# Altium schematic sheet System Control - Power.SchDoc
size C
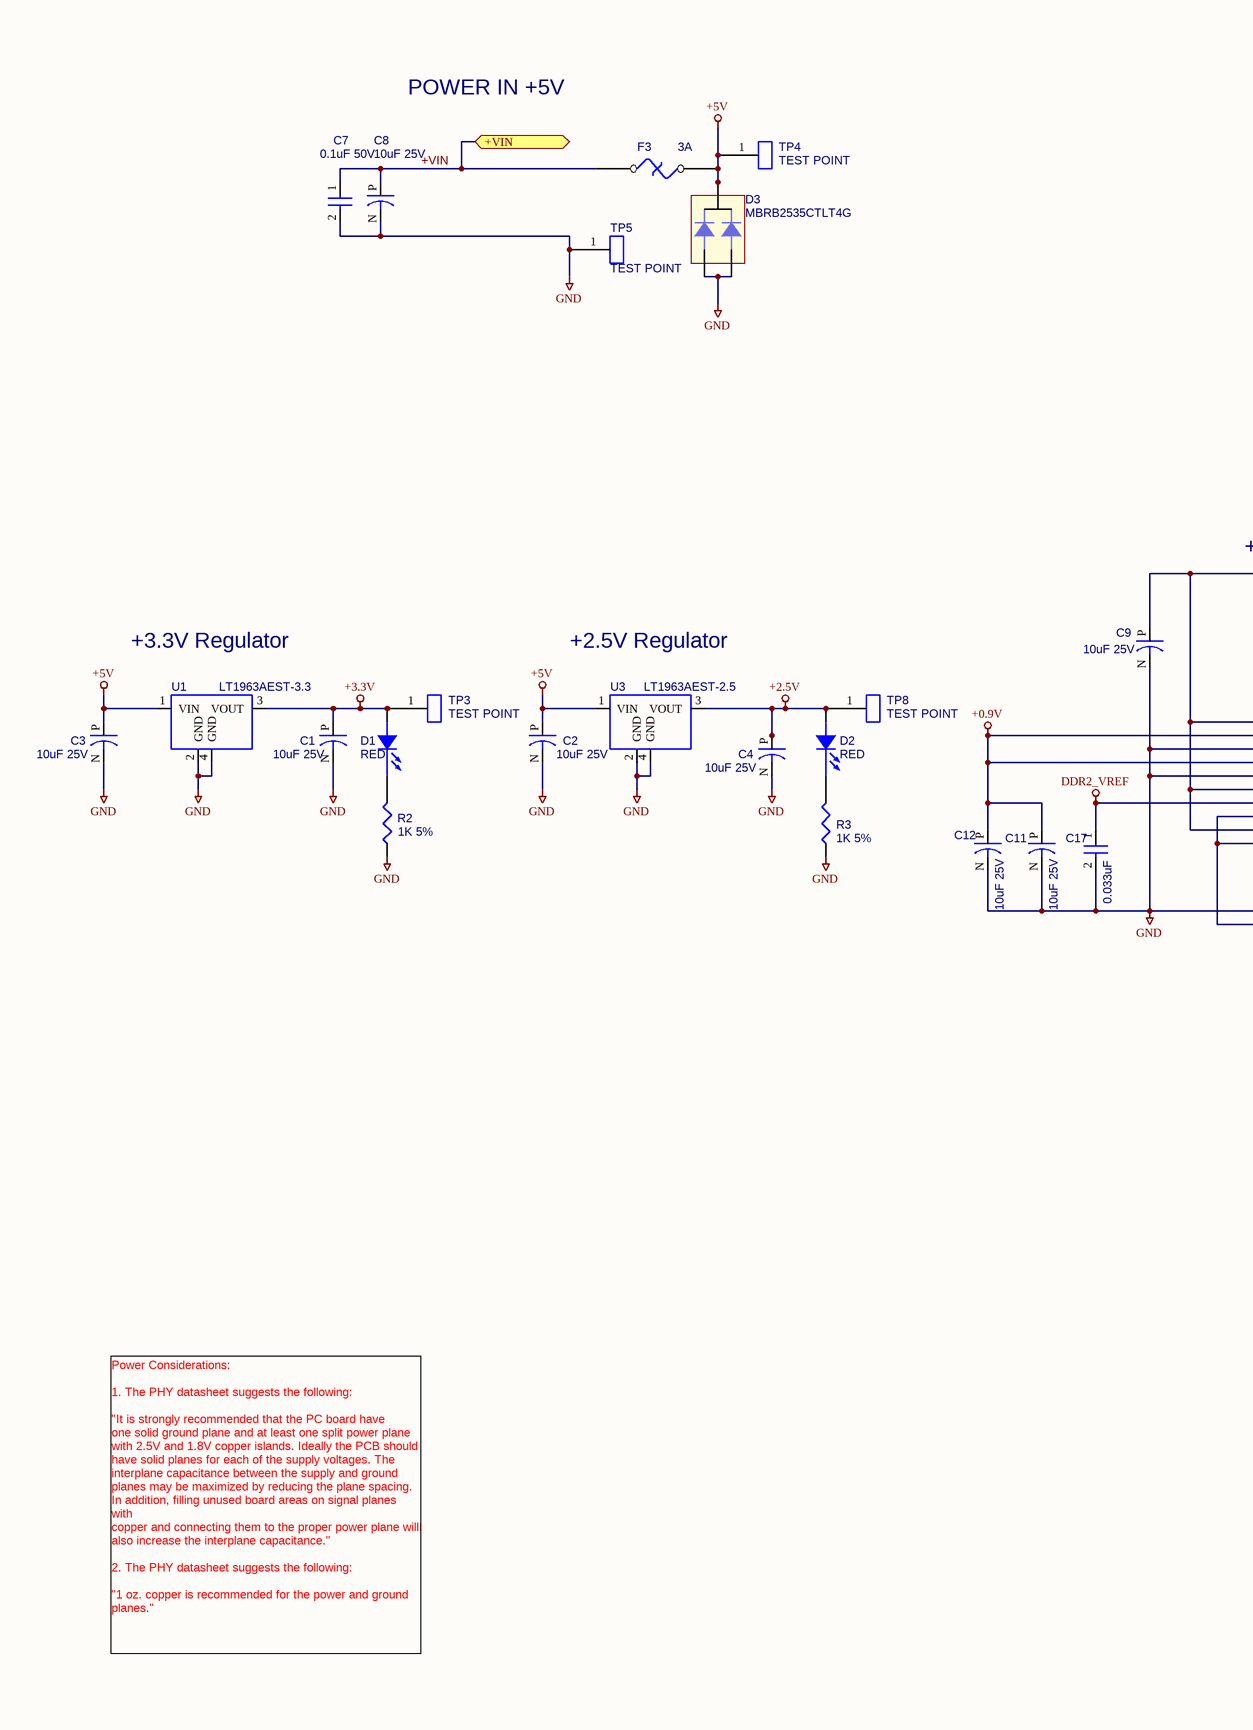
[diagram p0: System Control - Power.SchDoc, left]
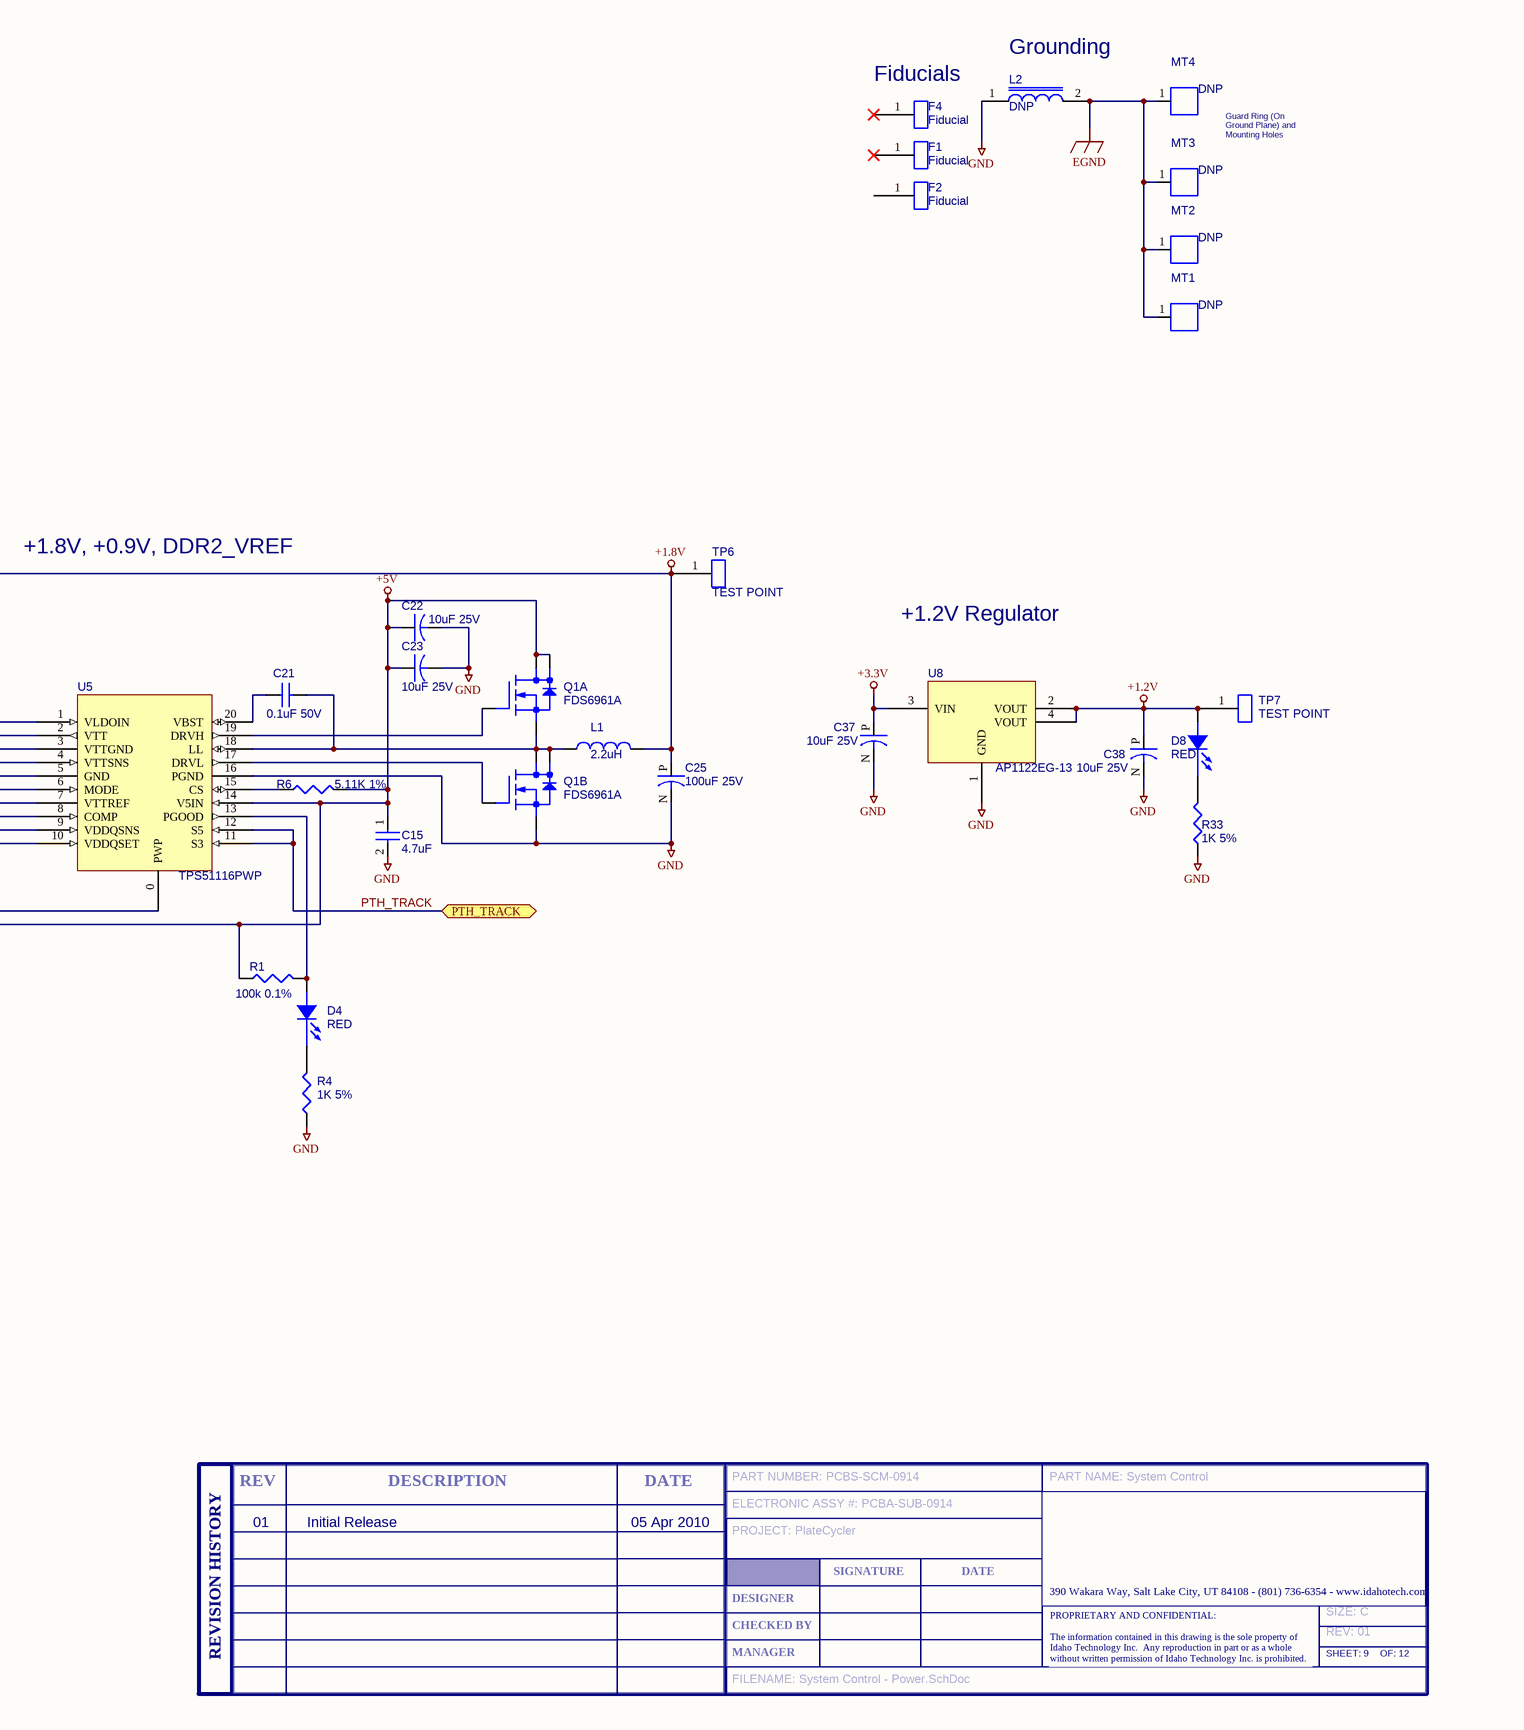
[diagram p1: System Control - Power.SchDoc, right]

## Parts
C1  10uF 25V  [SM/CT_6032]
C2  10uF 25V  [SM/CT_6032]
C3  10uF 25V  [SM/CT_6032]
C4  10uF 25V  [SM/CT_6032]
C7  0.1uF 50V  [SM/C_1206]
C8  10uF 25V  [SM/CT_6032]
C9  10uF 25V  [SM/CT_6032]
C11  10uF 25V  [SM/CT_6032]
C12  10uF 25V  [SM/CT_6032]
C15  4.7uF  [SM/C_0603]
C17  0.033uF  [SM/C_0603]
C21  0.1uF 50V  [SM/C_0603]
C22  10uF 25V  [SM/CT_6032]
C23  10uF 25V  [SM/CT_6032]
C25  100uF 25V  [SM/CT_7360]
C37  10uF 25V  [SM/CT_6032]
C38  10uF 25V  [SM/CT_6032]
D1  RED  [LED 1206]
D2  RED  [LED 1206]
D3  MBRB2535CTLT4G  [D2PAK]
D4  RED  [LED 1206]
D8  RED  [LED 1206]
F1  Fiducial  [FIDUCAL]  (no BOM)
F2  Fiducial  [FIDUCAL]  (no BOM)
F3  3A  [SMD - Fuse]
F4  Fiducial  [FIDUCAL]  (no BOM)
L1  2.2uH  [IHLP-1616BZ-11]
L2  DNP  [TDX Inductor]  (no BOM)
MT1  DNP  [STANDOFF_0.156]  (no BOM)
MT2  DNP  [STANDOFF_0.156]  (no BOM)
MT3  DNP  [STANDOFF_0.156]  (no BOM)
MT4  DNP  [STANDOFF_0.156]  (no BOM)
Q1  FDS6961A  [SO8W_M]  (parts A,B of 2)
R1  100k 0.1%  [SM/R_0805]
R2  1K 5%  [SM/R_0603]
R3  1K 5%  [SM/R_0603]
R4  1K 5%  [SM/R_0603]
R6  5.11K 1%  [SM/R_0603]
R33  1K 5%  [SM/R_0603]
T?  SIZE: C  REV: 01  FILENAME: System Control - Power.SchDoc  PART NUMBER: PCBS-SCM-0914  PART NAME: System Control  ELECTRONIC ASSY #: PCBA-SUB-0914  PROJECT: PlateCycler  SHEET: 9  OF: 12  (hidden comment: ITI Title Block, A Size)  (graphical)
TP3  TEST POINT  [BLKCON.100/VH/TM1SQ/W.100/1]
TP4  TEST POINT  [BLKCON.100/VH/TM1SQ/W.100/1]
TP5  TEST POINT  [BLKCON.100/VH/TM1SQ/W.100/1]
TP6  TEST POINT  [BLKCON.100/VH/TM1SQ/W.100/1]
TP7  TEST POINT  [BLKCON.100/VH/TM1SQ/W.100/1]
TP8  TEST POINT  [BLKCON.100/VH/TM1SQ/W.100/1]
U1  LT1963AEST-3.3  [SM/SOT223_1234]
U3  LT1963AEST-2.5  [SM/SOT223_1234]
U5  TPS51116PWP  [TSSOP20 - PWP]
U8  AP1122EG-13  [SM/SOT223_1234]

## Ports
+VIN, PTH_TRACK

## Nets
+0.9V: C11.P C12.P U5.2(VTT) U5.4(VTTSNS)
+1.2V: C38.P D8.1(ANODE) TP7.1 U8.2(VOUT) U8.4(VOUT)
+1.8V: C9.P C25.P L1.2 TP6.1 U5.1(VLDOIN) U5.6(MODE) U5.9(VDDQSNS)
+2.5V: C4.P D2.1(ANODE) TP8.1 U3.3(VOUT)
+3.3V: C1.P C37.P D1.1(ANODE) TP3.1 U1.3(VOUT) U8.3(VIN)
+5V: C2.P C3.P C15.1 C22.P C23.P D3.2 F3.2 Q1.7(D1) Q1.8(D1) R1.1 R6.2 TP4.1 U1.1(VIN) U3.1(VIN) U5.8(COMP) U5.10(VDDQSET) U5.14(V5IN)
DDR2_VREF: C17.1 U5.7(VTTREF)
EGND: L2.2 MT1.1 MT2.1 MT3.1 MT4.1
GND: C1.N C2.N C3.N C4.N C7.2 C8.N C9.N C11.N C12.N C15.2 C17.2 C22.N C23.N C25.N C37.N C38.N D3.1 D3.3 L2.1 Q1.3(S2) R2.1 R3.1 R4.1 R33.1 TP5.1 U1.2(GND) U1.4(GND) U3.2(GND) U3.4(GND) U5.0(PWP) U5.3(VTTGND) U5.5(GND) U5.16(PGND) U8.1(GND)
+VIN: C7.1 C8.P F3.1 ; port +VIN
PTH_TRACK: U5.11(S3) U5.12(S5) ; port PTH_TRACK
NetC21_1: C21.1 U5.20(VBST)
NetC21_2: C21.2 L1.1 Q1.1(S1) Q1.5(D2) Q1.6(D2) U5.18(LL)
NetD1_2: D1.2(CATHODE) R2.2
NetD2_2: D2.2(CATHODE) R3.2
NetD4_1: D4.1(ANODE) R1.2 U5.13(PGOOD)
NetD4_2: D4.2(CATHODE) R4.2
NetD8_2: D8.2(CATHODE) R33.2
NetQ1_2: Q1.2(G1) U5.19(DRVH)
NetQ1_4: Q1.4(G2) U5.17(DRVL)
NetR6_1: R6.1 U5.15(CS)

Not connected (* = marked no-connect by the designer): F1 1*; F2 1; F4 1*

## Notes on the sheet
- (near L2) Grounding
- POWER IN +5V
- Fiducials
- Guard Ring (On
  Ground Plane) and
  Mounting Holes
- +1.8V, +0.9V, DDR2_VREF
- +3.3V Regulator
- +2.5V Regulator
- +1.2V Regulator
- 01
- Initial Release
- 05 Apr 2010
- Power Considerations:
  1. The PHY datasheet suggests the following:
  "It is strongly recommended that the PC board have
  one solid ground plane and at least one split power plane
  with 2.5V and 1.8V copper islands. Ideally the PCB should
  have solid planes for each of the supply voltages. The
  interplane capacitance between the supply and ground
  planes may be maximized by reducing the plane spacing.
  In addition, filling unused board areas on signal planes with
  copper and connecting them to the proper power plane will
  also increase the interplane capacitance."
  2. The PHY datasheet suggests the following:
  "1 oz. copper is recommended for the power and ground planes."
- (in symbol ITI A-size Title Block and Rev Table) REV; DESCRIPTION; DATE; SIGNATURE; 390 Wakara Way, Salt Lake City, UT 84108 - (801) 736-6354 - www.idahotech.com; DESIGNER; CHECKED BY; REVISION HISTORY; MANAGER; PROPRIETARY AND CONFIDENTIAL: / The information contained in this drawing is the sole property of / Idaho Technology Inc.  Any reproduction in part or as a whole / without written permission of Idaho Technology Inc. is prohibited.

## Library data of the parts
C1-C4 C8 C9 C11 C12 C22 C23 C37 C38 = CAP_1: SMD Tantalum Capacitors 10uF 25V 20% L ESR; Manufacturer P/N: TPSC106M025R0500; Manufacturer: AVX; Vendor P/N: 581-TPSC106M025R0500; Vendor: Mouser
C7 = CAP NP_1: CAP .1UF 50V CERM CHIP 1206 X7R; Manufacturer P/N: ECJ-3VB1H104K; Manufacturer: Panasonic; Vendor P/N: PCC104BCT-ND; Vendor: Digikey
C15 = CAP NP_1: CAP CER 4.7UF 10V Y5V 0603; Manufacturer P/N: GRM188F51A475ZE20D; Manufacturer: Murata; Vendor P/N: 490-3302-1-ND; Vendor: Digikey
C17 = CAP NP_1: CAP .033UF 50V CERAMIC X7R 0603; Manufacturer P/N: ECJ-1VB1H333K; Manufacturer: Panasonic; Vendor P/N: PCC2284CT-ND; Vendor: Digikey
C21 = CAP NP_1: CAP CER .10UF 50V X7R 0603; Manufacturer P/N: UMK107B7104KA-T; Manufacturer: Taiyo Yuden; Vendor P/N: 587-1243-1-ND; Vendor: Digikey
C25 = CAP_1: CAPACITOR TANT 100UF 25V 20% SMD; Manufacturer: Kemet; Manufacturer P/N: T510E107M025AT E050; Vendor: Digikey; Vendor P/N: 399-3989-1-ND
D1 D2 D4 D8 = LED: LED 635NM RED WTR CLR 1206 SMD; Manufacturer: Lumex; Manufacturer P/N: SML-LX1206IC-TR; Vendor: Digikey; Vendor P/N: 67-1356-1-ND
D3 = MBRB2535CTLT4G: On Semi Switchmode Power Rectifier; Manufacturer: On Semiconductor; Rated Voltage: 35 V; Vendor: Digikey; Vendor P/N: MBRB2535CTLT4GOSCT-ND; Rated Amps: 25 A; Manufacturer P/N: MBRB2535CTLT4G
F1 F2 F4 = TEST POINT
F3 = FUSE THERMAL: FUSEBLOCK W/3A FUSE SMD FAST; Manufacturer P/N: 0154003.DR; Manufacturer: Littelfuse Inc; Vendor P/N: F1226CT-ND; Vendor: Digikey; Price: 2.62
L1 = INDUCTOR: INDUCTOR POWER 2.2UH 3.25A SMD; Manufacturer P/N: IHLP1616BZER2R2M11; Manufacturer: Vishay/Dale; Vendor P/N: 541-1050-1-ND; Vendor: Digikey
L2 = TDK Inductor: INDUCTOR WW PWR 47UH 260MA 10%; Manufacturer P/N: NLC453232T-470K-PF; Manufacturer: TDK; Vendor P/N: 445-1964-1-ND; Vendor: Digikey
MT1 = CON1_0: Right: 20; COMPGROUP: 1; COMPSIDE: TOP; COMPLOC: [165.000,4835.000]; COMPROT: 0; COMPFIXED: NO; COMPHEIGHT: 0.000; Bottom: 20; COMPLOCKED: NO; COMPKEY: NO; DECOUPLER: NO; MEMORY: NO
MT2 = CON1_0: Right: 20; COMPGROUP: 1; COMPSIDE: TOP; COMPLOC: [6834.000,4835.000]; COMPROT: 0; COMPFIXED: NO; COMPHEIGHT: 0.000; Bottom: 20; COMPLOCKED: NO; COMPKEY: NO; DECOUPLER: NO; MEMORY: NO
MT3 = CON1_0: Right: 20; COMPGROUP: 1; COMPSIDE: TOP; COMPLOC: [165.000,165.000]; COMPROT: 0; COMPFIXED: NO; COMPHEIGHT: 0.000; Bottom: 20; COMPLOCKED: NO; COMPKEY: NO; DECOUPLER: NO; MEMORY: NO
MT4 = CON1_0: Right: 20; COMPHEIGHT: 0.000; MEMORY: NO; COMPROT: 0; COMPLOC: [6834.000,165.000]; COMPSIDE: TOP; COMPGROUP: 1; Bottom: 20; DECOUPLER: NO; COMPKEY: NO; COMPLOCKED: NO; COMPFIXED: NO
Q1 = FDS6961A: MOSFET N-CH DUAL 30V 3.5A 8SOIC; Manufacturer: Fairchild Semiconductor; Vendor: Digikey; Vendor P/N: FDS6961ACT-ND; Manufacturer P/N: FDS6961A
R1 = RESISTOR_0_Dup1: RES 100K OHM 1/10W .1% 0805 SMD; Manufacturer: Panasonic; Manufacturer P/N: ERA-6YEB104V; Vendor: Digikey; Vendor P/N: P100KZCT-ND
R2-R4 = R1K 5% 0603: RES 1.0K OHM 1/10W 5% 0603 SMD; Manufacturer: Panasonic; Manufacturer P/N: ERJ-3GEYJ102V; Vendor P/N: P1.0KGCT-ND; Vendor P/N: Digikey
R6 = RESISTOR_0_Dup1: RES 5.11K OHM 1/10W 1% 0603 SMD; Manufacturer: Panasonic; Manufacturer P/N: ERJ-3EKF5111V; Vendor: Digikey; Vendor P/N: P5.11KHCT-ND
R33 = R1K 5% 0603: RES 1.0K OHM 1/10W 5% 0603 SMD; Manufacturer: Panasonic; Manufacturer P/N: ERJ-3GEYJ102V; Vendor P/N: P1.0KGCT-ND; Vendor: Digikey
T? = ITI A-size Title Block and Rev Table: ITI Title Block and Rev Table, A Size
TP3 TP4 TP6-TP8 = TEST POINT: TEST POINT PC MINI .040"D RED; Manufacturer P/N: 5000; Manufacturer: Keystone Electronics; Vendor P/N: 5000K-ND; Vendor: Digikey
TP5 = TEST POINT: TEST POINT PC MINI .040"D BLACK; Manufacturer P/N: 5001; Manufacturer: Keystone Electronics; Vendor P/N: 5001K-ND; Vendor: Digikey
U1 = LT1963A: IC REG LDO LN 1.5A 3.3V SOT-223; Manufacturer P/N: LT1963AEST-3.3#PBF; Manufacturer: Linear Technology; Vendor P/N: LT1963AEST-3.3#PBF-ND; Vendor: Digikey
U3 = LT1963A: IC REG LDO LN 1.5A 2.5V SOT223-3; Manufacturer P/N: LT1963AEST-2.5#PBF; Manufacturer: Linear Technology; Vendor P/N: LT1963AEST-2.5#PBF-ND; Vendor: Digikey
U5 = TPS51116PWP: Controllers - DC/DC DDR2 SWITCHER AND LDO; Manufacturer: Texas Instruments; Vendor P/N: 595-TPS51116PWP; Vendor: Mouser; Manufacturer P/N: TPS51116PWP
U8 = AP1122EG-13: IC REG LDO 1.0A POS SOT223; Manufacturer: Diodes Inc; Vendor: Digikey; Vendor P/N: AP1122EGDICT-ND; Manufacturer P/N: AP1122EG-13; Desc: IC REG LDO 1.0A POS SOT223; Price: 1.05